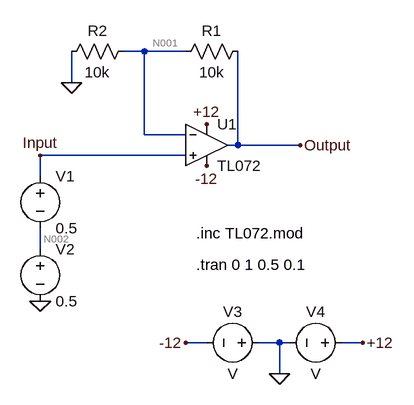
[diagram p0: schematic noninverting.asc]
noninverting.asc, the LTspice schematic file:
Version 4
SHEET 1 880 680
WIRE 256 0 224 0
WIRE 320 0 256 0
WIRE 144 48 144 0
WIRE 256 128 256 0
WIRE 320 128 256 128
WIRE 400 144 400 0
WIRE 400 144 384 144
WIRE 496 144 400 144
WIRE 320 160 96 160
WIRE 96 192 96 160
WIRE 96 304 96 272
WIRE 352 448 320 448
WIRE 464 448 432 448
WIRE 480 448 464 448
WIRE 592 448 560 448
WIRE 464 496 464 448
FLAG 96 384 0
FLAG 144 48 0
FLAG 496 144 Output
FLAG 96 160 Input
FLAG 464 496 0
FLAG 320 448 -12
FLAG 592 448 +12
FLAG 352 176 -12
FLAG 352 112 +12
SYMBOL voltage 96 176 R0
WINDOW 123 0 0 Left 0
WINDOW 39 0 0 Left 0
SYMATTR InstName V1
SYMATTR Value 0.5
SYMBOL Opamps\\opamp2 352 80 R0
SYMATTR InstName U1
SYMATTR Value TL072
SYMBOL voltage 96 288 R0
WINDOW 123 0 0 Left 0
WINDOW 39 0 0 Left 0
SYMATTR InstName V2
SYMATTR Value 0.5
SYMBOL res 240 -16 R90
WINDOW 0 0 56 VBottom 2
WINDOW 3 32 56 VTop 2
SYMATTR InstName R2
SYMATTR Value 10k
SYMBOL res 416 -16 R90
WINDOW 0 0 56 VBottom 2
WINDOW 3 32 56 VTop 2
SYMATTR InstName R1
SYMATTR Value 10k
SYMBOL voltage 448 448 R90
WINDOW 0 -32 56 VBottom 2
WINDOW 3 32 56 VTop 2
SYMATTR InstName V3
SYMBOL voltage 576 448 R90
WINDOW 0 -32 56 VBottom 2
WINDOW 3 32 56 VTop 2
SYMATTR InstName V4
TEXT 336 328 Left 2 !.tran 0 1 0.5 0.1
TEXT 336 280 Left 2 !.inc TL072.mod

The netlist it stands for:
* noninverting.asc
V1 Input N002 0.5
XU1 Input N001 +12 -12 Output TL072  ; pins In+ In- V+ V- OUT
V2 N002 0 0.5
R2 N001 0 10k
R1 Output N001 10k
V3 0 -12 V
V4 +12 0 V
.tran 0 1 0.5 0.1
.inc TL072.mod
.backanno
.end

* Results of the author's LTspice run, read from the files saved beside the schematic
* Operating Point, zero values left out:
*   V(input) = 1 V
*   V(n002) = 500 mV
*   V(n001) = 145.5 mV
*   I(R1) = -14.55 µA
*   I(R2) = 14.55 µA
*   I(V4) = 706.6 GA
*   I(V3) = 706.6 GA
*   I(V2) = -31.27 pA
*   I(V1) = -31.27 pA
*   Ix(u1:1) = 31.27 pA
*   Ix(u1:2) = -29.1 µA
*   Ix(u1:3) = -706.6 GA
*   Ix(u1:4) = 706.6 GA